# EAGLE design schema (EAGLE 8.3.1)
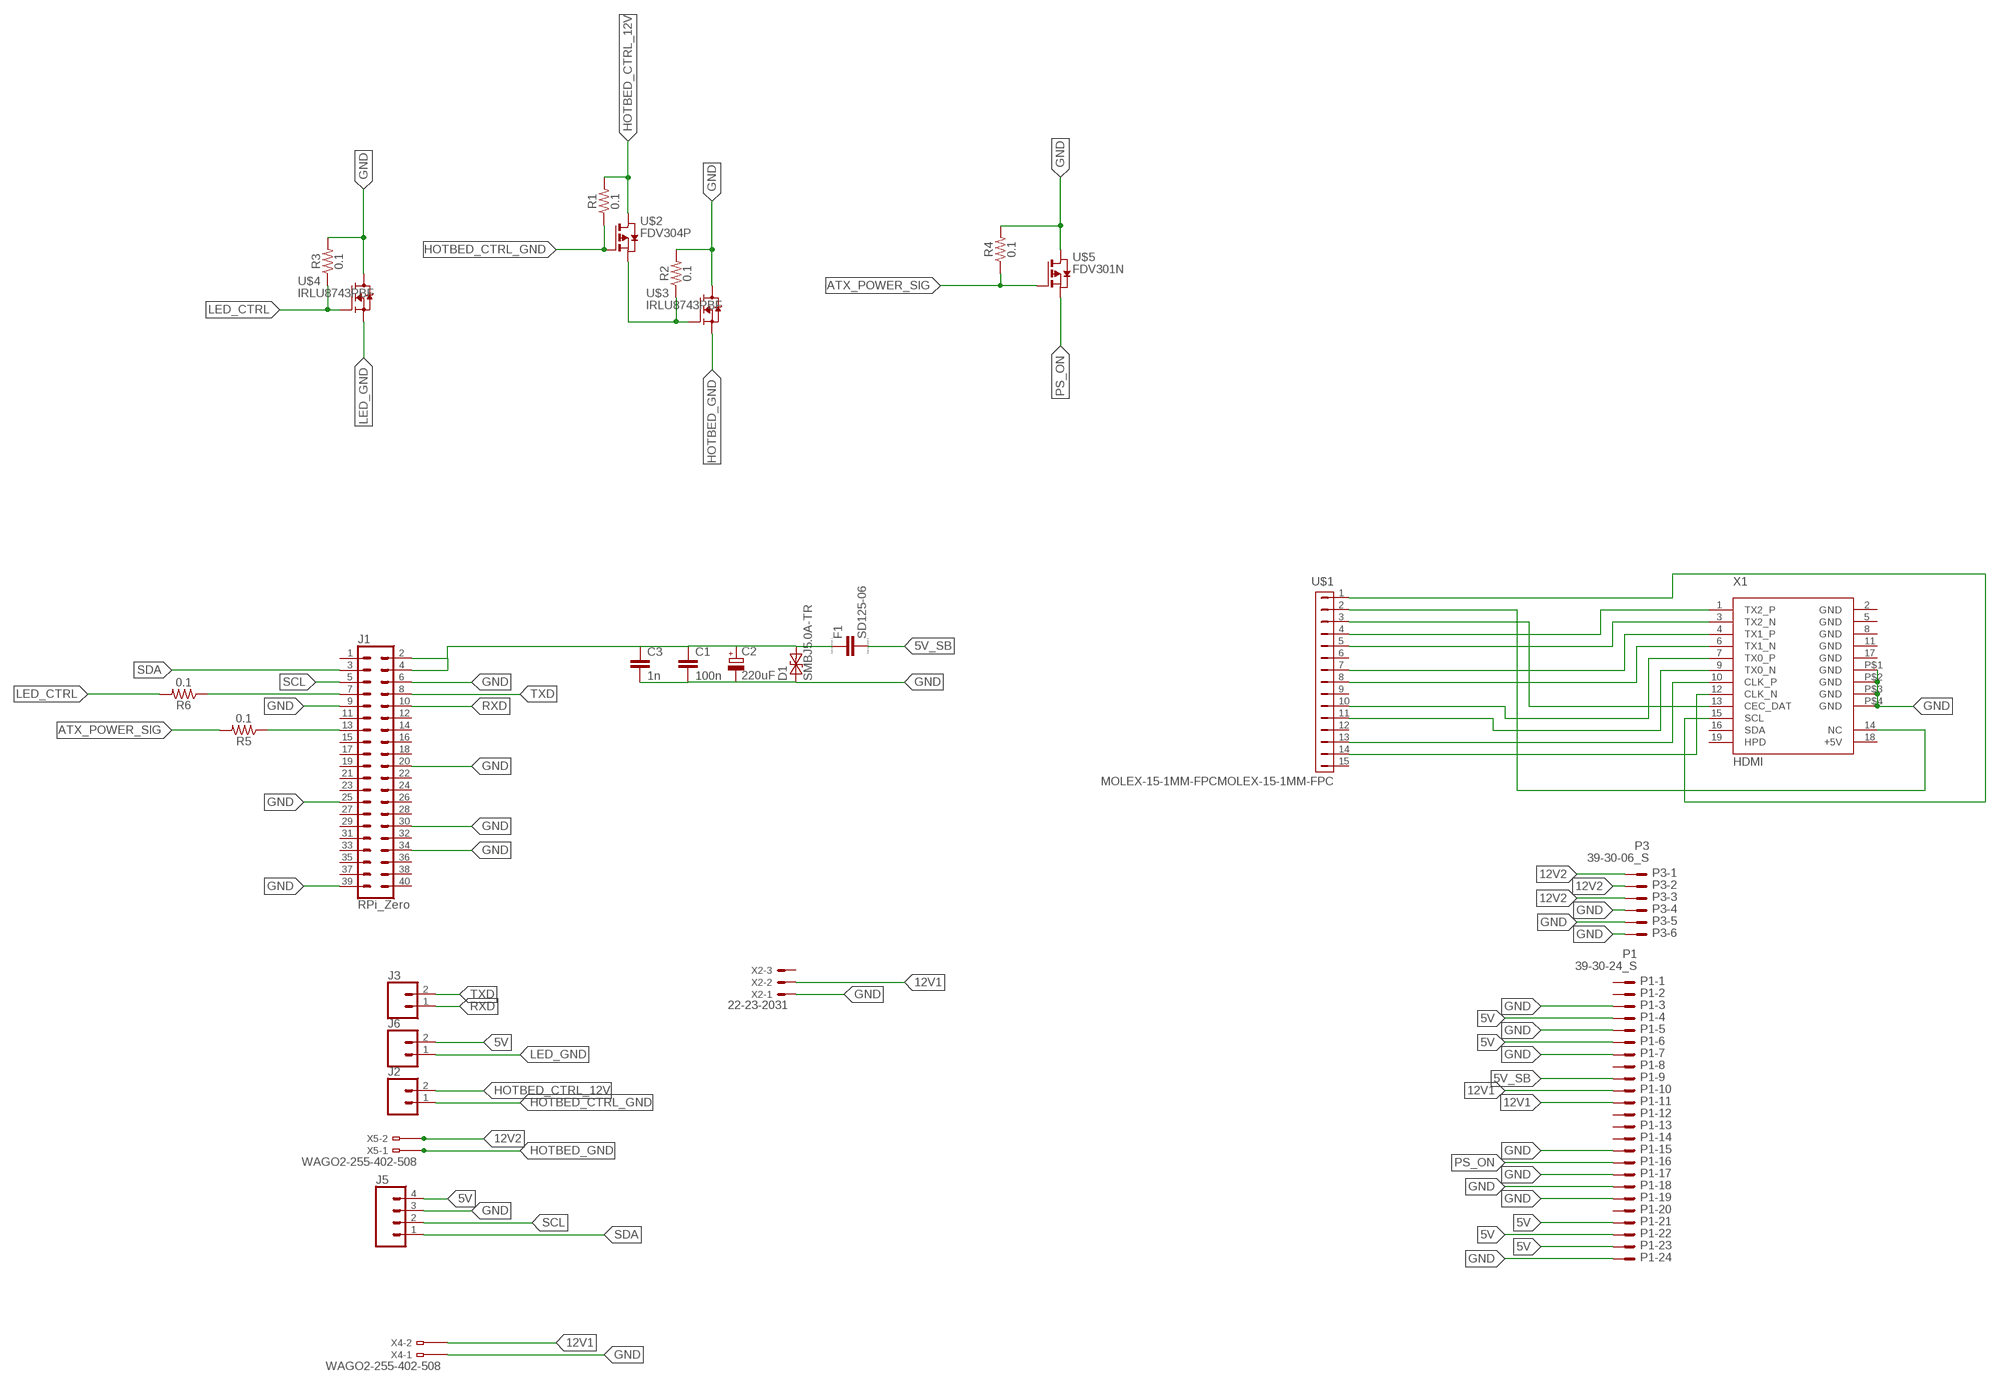
[diagram p0: schematic, sheet 1]

## Parts
C1  100n  C-EUC1206  [C1206]
C2  220uF  CPOL-EUSMCE  [SMC_E]
C3  1n  C-EUC1206  [C1206]
D1  SMBJ5.0A-TR  P6SMB_CA  [SMB]
F1  SD125-06  CC1812  [C1812]
J1  RPi_Zero  CONN_20X2  [2X20]
J2  CONN_02  [1X02]
J3  CONN_02  [1X02]
J5  CONN_04  [1X04]
J6  CONN_025MM  [SCREWTERMINAL-5MM-2]
P1  39-30-24_S  [39-30-?24?]
P3  39-30-06_S  [39-30-?06?]
R1  0.1  0.1OHM-1210-1/2W-1%  [1210]
R2  0.1  0.1OHM-1210-1/2W-1%  [1210]
R3  0.1  0.1OHM-1210-1/2W-1%  [1210]
R4  0.1  0.1OHM-1210-1/2W-1%  [1210]
R5  0.1  0.1OHM-1210-1/2W-1%  [1210]
R6  0.1  0.1OHM-1210-1/2W-1%  [1210]
U$1  MOLEX-15-1MM-FPCMOLEX-15-1MM-FPC  [FH12-15S-1SH]
U$2  FDV304P  [SOT-23]
U$3  IRLU8743PBF  [TO-251AA]
U$4  IRLU8743PBF  [TO-251AA]
U$5  FDV301N  FDV304P  [SOT-23]
X1  HDMI  [HDMI]
X2  22-23-2031  [22-23-2031]
X4  WAGO2-255-402-508  [255-402-508]
X5  WAGO2-255-402-508  [255-402-508]

## Nets
5V: J5.4 J6.2 P1.4 P1.6 P1.21 P1.22 P1.23
5V_SB: F1.2 P1.9
5V_SB_FUSED: C1.1 C2.+ C3.1 D1.2 F1.1 J1.2 J1.4
12V1: P1.10 P1.11 X2.2 X4.B2(-2:B1)
12V2: P3.1 P3.2 P3.3 X5.B2(-2:B1)
ATX_POWER_SIG: R4.1 R5.2 U$5.2(G)
GND: C1.2 C2.- C3.2 D1.1 J1.6 J1.9 J1.20 J1.25 J1.30 J1.34 J1.39 J5.3 P1.3 P1.5 P1.7 P1.15 P1.17 P1.18 P1.19 P1.24 P3.4 P3.5 P3.6 R2.2 R3.2 R4.2 U$3.2(D) U$3.4(D) U$4.2(D) U$4.4(D) U$5.1(D) X1.P$1(GND) X1.P$2(GND) X1.P$3(GND) X1.P$4(GND) X2.1 X4.B1(-1:B1)
GPIO_7: J1.7 R6.1
GPIO_13: J1.13 R5.1
HOTBED_CTRL_12V: J2.2 R1.2 U$2.1(D)
HOTBED_CTRL_GND: J2.1 R1.1 U$2.2(G)
HOTBED_GND: U$3.3(S) X5.B1(-1:B1)
LED_CTRL: R3.1 R6.2 U$4.1(G)
LED_GND: J6.1 U$4.3(S)
N$1: R2.1 U$2.3(S) U$3.1(G)
N$3: U$1.2 X1.14(NC)
N$4: U$1.1 X1.15(SCL)
N$5: U$1.14 X1.12(CLK_N)
N$6: U$1.4 X1.1(TX2_P)
N$7: U$1.5 X1.3(TX2_N)
N$8: U$1.7 X1.4(TX1_P)
N$9: U$1.8 X1.6(TX1_N)
N$10: U$1.10 X1.7(TX0_P)
N$11: U$1.11 X1.9(TX0_N)
N$12: U$1.13 X1.10(CLK_P)
N$13: U$1.3 X1.13(CEC_DAT)
PS_ON: P1.16 U$5.3(S)
RXD: J1.10 J3.1
SCL: J1.5 J5.2
SDA: J1.3 J5.1
TXD: J1.8 J3.2
Unconnected: J1.1 J1.11 J1.12 J1.14 J1.15 J1.16 J1.17 J1.18 J1.19 J1.21 J1.22 J1.23 J1.24 J1.26 J1.27 J1.28 J1.29 J1.31 J1.32 J1.33 J1.35 J1.36 J1.37 J1.38 J1.40 P1.1 P1.2 P1.8 P1.12 P1.13 P1.14 P1.20 U$1.6 U$1.9 U$1.12 U$1.15 X1.2(GND) X1.5(GND) X1.8(GND) X1.11(GND) X1.16(SDA) X1.17(GND) X1.18(+5V) X1.19(HPD) X2.3 X4.A1(-1:A1) X4.A2(-2:A1) X5.A1(-1:A1) X5.A2(-2:A1)

## Library data of the parts
C1 C3 = rcl:C-EU: CAPACITOR, European symbol
C2 = rcl:CPOL-EU: POLARIZED CAPACITOR, European symbol
D1 = _hhn_suppressor_SMAJ_SM6T_P6SMB:P6SMB*CA: P6SMBxxCA Series of bidirectional Transient Voltage Suppressor Diodes xx = Stand-off Voltage VR in Volts; PPmax = 600 W Case: SMB = DO 214 AA Note: Footprint acc. to ST specs; source: www.st.com Author: Dipl.-Ing. FH Rainer Bayer, www.ing-rb.de/hhn Feedback: rainer.bayer@hs-heilbronn.de
F1 = eagle-ltspice:C: CAPACITOR, European symbol; SPICEMODEL: NONE; SPICEPREFIX: C
J1 = SparkFun-Connectors:CONN_20X2: Multi connection point. Often used as Generic Header-pin footprint for 0.1 inch spaced/style header connections On any of the 0.1 inch spaced packages, you can populate with these: Break Away Headers - Straight <https://www.sparkfun.com/products/116> (PRT-00116) Break Away Male Headers - Right Angle <https://www.sparkfun.com/products/553> (PRT-00553) Female Headers <https://www.sparkfun.com/products/115> (PRT-00115) Break Away Headers - Machine Pin <https://www.sparkfun.com/products/117> (PRT-00117) Break Away Female Headers - Swiss Machine Pin <https://www.sparkfun.com/products/743> (PRT-00743)
J2 J3 = SparkFun-Connectors:CONN_02: Multi connection point. Often used as Generic Header-pin footprint for 0.1 inch spaced/style header connections On any of the 0.1 inch spaced packages, you can populate with these: Break Away Headers - Straight <https://www.sparkfun.com/products/116> (PRT-00116) Break Away Male Headers - Right Angle <https://www.sparkfun.com/products/553> (PRT-00553) Female Headers <https://www.sparkfun.com/products/115> (PRT-00115) Break Away Headers - Machine Pin <https://www.sparkfun.com/products/117> (PRT-00117) Break Away Female Headers - Swiss Machine Pin <https://www.sparkfun.com/products/743> (PRT-00743) For SCREWTERMINALS and SPRING TERMINALS visit here: Screw Terimnals on SparkFun.com <https://www.sparkfun.com/search/results?term=Screw+Terminals> (5mm/3.5mm/2.54mm spacing) This device is also useful as a general connection point to wire up your design to another part of your project. Our various solder wires solder well into these plated through hole pads. Hook-Up Wire - Assortment (Stranded, 22 AWG) <https://www.sparkfun.com/products/11375> (PRT-11375) Hook-Up Wire - Assortment (Solid Core, 22 AWG) <https://www.sparkfun.com/products/11367> (PRT-11367) View the entire wire category on our website here <https://www.sparkfun.com/categories/141> Special notes: Molex polarized connector foot print use with: PRT-08233 with associated crimp pins and housings. 2.54_SCREWTERM for use with PRT-10571. 3.5mm Screw Terminal footprints for PRT-08084 5mm Screw Terminal footprints for use with PRT-08432
J5 = SparkFun-Connectors:CONN_04: Multi connection point. Often used as Generic Header-pin footprint for 0.1 inch spaced/style header connections On any of the 0.1 inch spaced packages, you can populate with these: Break Away Headers - Straight <https://www.sparkfun.com/products/116> (PRT-00116) Break Away Male Headers - Right Angle <https://www.sparkfun.com/products/553> (PRT-00553) Female Headers <https://www.sparkfun.com/products/115> (PRT-00115) Break Away Headers - Machine Pin <https://www.sparkfun.com/products/117> (PRT-00117) Break Away Female Headers - Swiss Machine Pin <https://www.sparkfun.com/products/743> (PRT-00743) For SCREWTERMINALS and SPRING TERMINALS visit here: Screw Terimnals on SparkFun.com <https://www.sparkfun.com/search/results?term=Screw+Terminals> (5mm/3.5mm/2.54mm spacing) This device is also useful as a general connection point to wire up your design to another part of your project. Our various solder wires solder well into these plated through hole pads. Hook-Up Wire - Assortment (Stranded, 22 AWG) <https://www.sparkfun.com/products/11375> (PRT-11375) Hook-Up Wire - Assortment (Solid Core, 22 AWG) <https://www.sparkfun.com/products/11367> (PRT-11367) View the entire wire category on our website here <https://www.sparkfun.com/categories/141> Special notes: Molex polarized connector foot print use with SKU : PRT-08231 with associated crimp pins and housings. 1MM SMD Version SKU: PRT-10208; PROD_ID: CONN-09696
J6 = SparkFun-Connectors:CONN_02: Multi connection point. Often used as Generic Header-pin footprint for 0.1 inch spaced/style header connections On any of the 0.1 inch spaced packages, you can populate with these: Break Away Headers - Straight <https://www.sparkfun.com/products/116> (PRT-00116) Break Away Male Headers - Right Angle <https://www.sparkfun.com/products/553> (PRT-00553) Female Headers <https://www.sparkfun.com/products/115> (PRT-00115) Break Away Headers - Machine Pin <https://www.sparkfun.com/products/117> (PRT-00117) Break Away Female Headers - Swiss Machine Pin <https://www.sparkfun.com/products/743> (PRT-00743) For SCREWTERMINALS and SPRING TERMINALS visit here: Screw Terimnals on SparkFun.com <https://www.sparkfun.com/search/results?term=Screw+Terminals> (5mm/3.5mm/2.54mm spacing) This device is also useful as a general connection point to wire up your design to another part of your project. Our various solder wires solder well into these plated through hole pads. Hook-Up Wire - Assortment (Stranded, 22 AWG) <https://www.sparkfun.com/products/11375> (PRT-11375) Hook-Up Wire - Assortment (Solid Core, 22 AWG) <https://www.sparkfun.com/products/11367> (PRT-11367) View the entire wire category on our website here <https://www.sparkfun.com/categories/141> Special notes: Molex polarized connector foot print use with: PRT-08233 with associated crimp pins and housings. 2.54_SCREWTERM for use with PRT-10571. 3.5mm Screw Terminal footprints for PRT-08084 5mm Screw Terminal footprints for use with PRT-08432; SF_SKU: PRT-08432
P1 = con-molex-mini-fit:39-30-?24?_S: HEADER
P3 = con-molex-mini-fit:39-30-?06?_S: HEADER
R1-R6 = SparkFun-Resistors:0.1OHM: 0.1Ω resistor A resistor is a passive two-terminal electrical component that implements electrical resistance as a circuit element. Resistors act to reduce current flow, and, at the same time, act to lower voltage levels within circuits. - Wikipedia; PROD_ID: RES-12374
U$1 = johny007:MOLEX-15-1MM-FPC
U$2 U$5 = johny007:FDV304P
U$3 U$4 = johny007:IRLU8743PBF
X1 = raspberrypi_cm:HDMI
X2 = con-molex:22-23-2031: .100" (2.54mm) Center Header - 3 Pin; MF: MOLEX; MPN: 22-23-2031; OC_FARNELL: 1462950; OC_NEWARK: 30C0862
X4 X5 = con-wago:WAGO2-: WAGO Cage Clamp; OC_FARNELL: unknown; OC_NEWARK: unknown

## Board
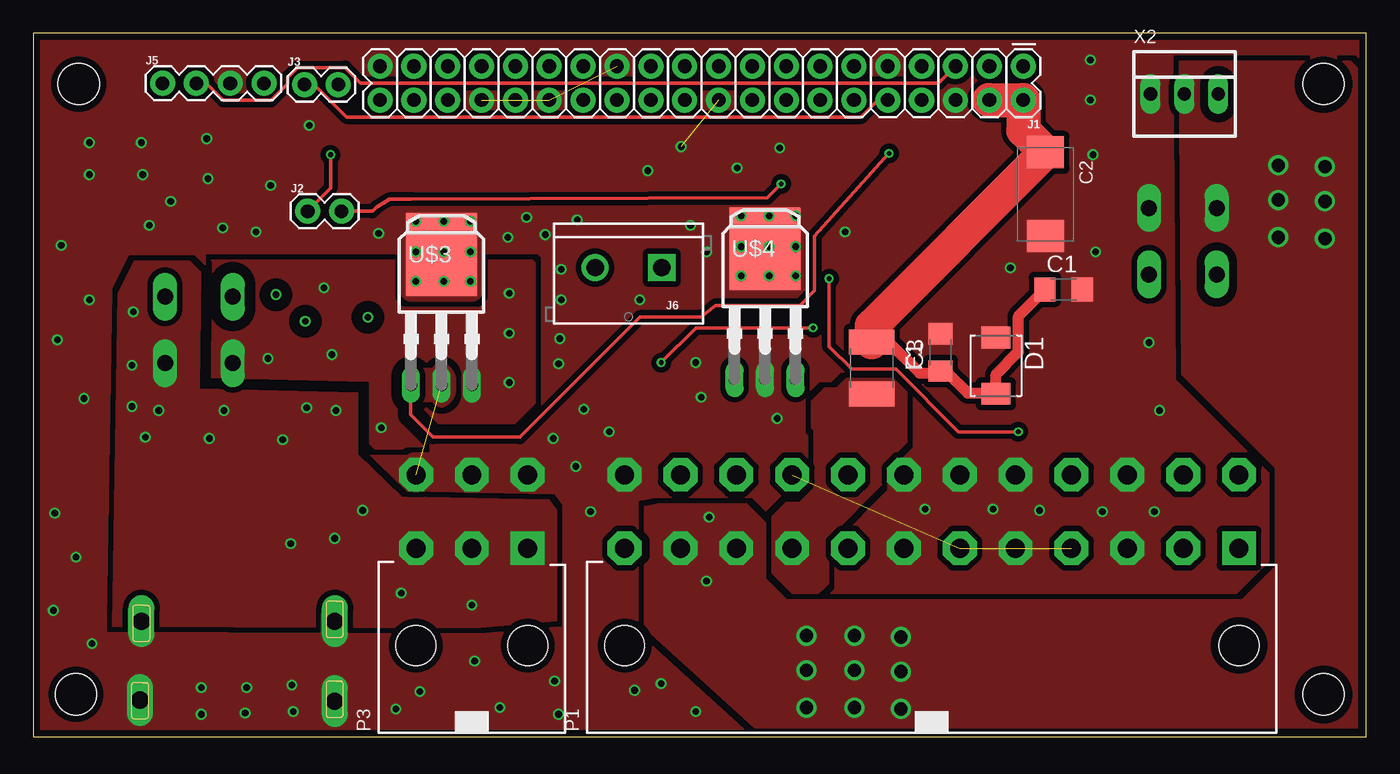
[diagram p1: board, top side]
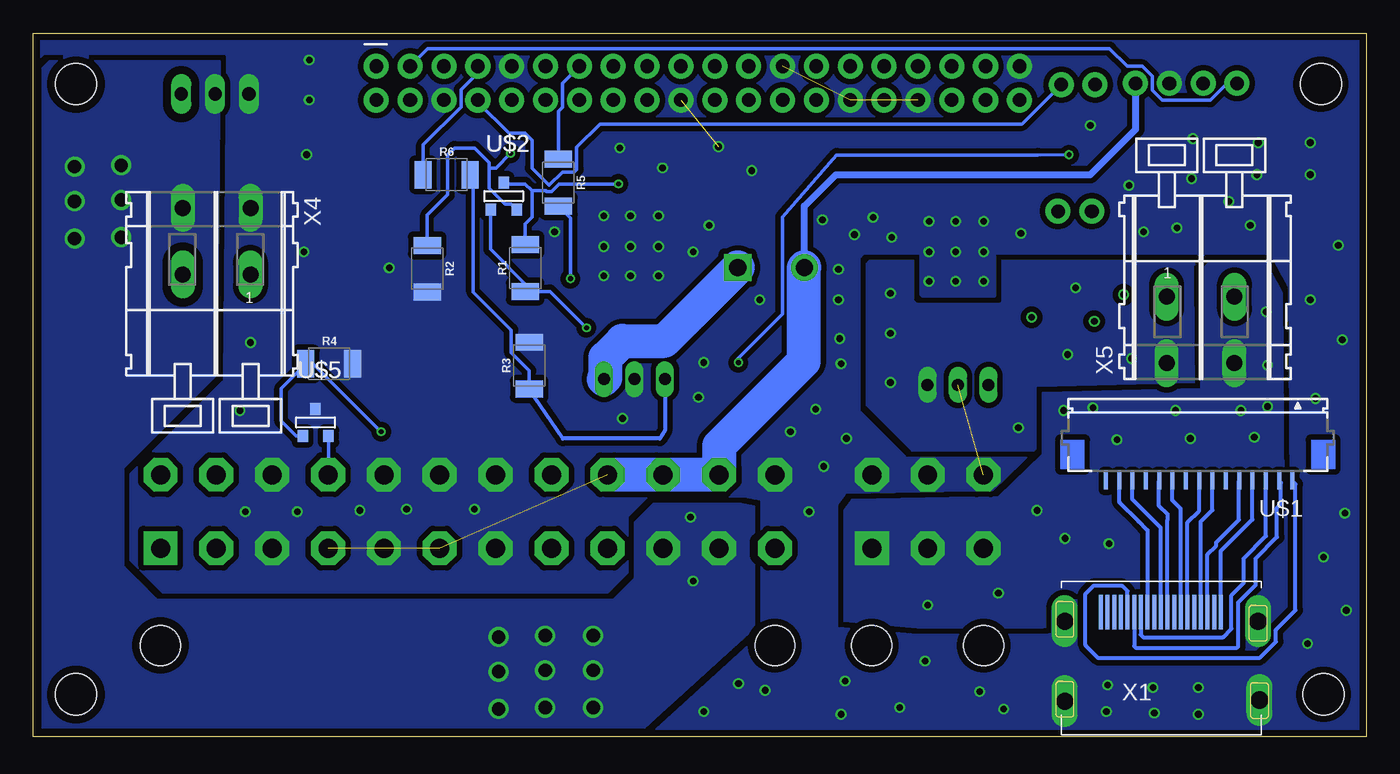
[diagram p2: board, bottom side, seen from below]

Size 100 x 52.81 mm. Coordinates in mm from the lower left corner, seen from the top.
Outline: 0,0 100,0 100,52.81 0,52.81 0,0
Copper layers (1*16): Top 0.035mm / dielectric 1.6mm / Bottom 0.035mm
Design rules "Elecrow_2-layer_PCB_eagle_rule": minimum track width 6mil, minimum drill 12mil, track to track 6mil, track to pad 6mil, pad to pad 6mil, via to via 8mil, smd to smd 0mil, copper to edge 20mil, drill to drill 10mil, minimum pad ring 6mil, minimum via ring 6mil, stop-mask expansion 0mil, vias tented up to drill 100mil, thermal gap 10mil
Holes 3.1 mm at 3.2,3.2 96.8,3.2 3.4,49 96.8,49

### Footprints (pad centres in the part's own frame; a part is rotated, then mirrored left to right if it is on the bottom)
C1206 = smd 1.6 x 1.8: 1 -1.4,0; 2 1.4,0
SMC_E = smd 2.4 x 2.8: + -3.15,0; - 3.15,0
SMB = smd 1.62 x 2.18: 1 -2.11,0; 2 2.11,0
C1812 = smd 1.9 x 3.4: 1 -1.95,0; 2 1.95,0
2X20 = drill 1.016 pad 1.88: 1 0,0; 2 0,2.54; 3 2.54,0; 4 2.54,2.54; 5 5.08,0; 6 5.08,2.54; 7 7.62,0; 8 7.62,2.54; 9 10.16,0; 10 10.16,2.54; 11 12.7,0; 12 12.7,2.54; 13 15.24,0; 14 15.24,2.54; 15 17.78,0; 16 17.78,2.54; 17 20.32,0; 18 20.32,2.54; 19 22.86,0; 20 22.86,2.54; 21 25.4,0; 22 25.4,2.54; 23 27.94,0; 24 27.94,2.54; 25 30.48,0; 26 30.48,2.54; 27 33.02,0; 28 33.02,2.54; 29 35.56,0; 30 35.56,2.54; 31 38.1,0; 32 38.1,2.54; 33 40.64,0; 34 40.64,2.54; 35 43.18,0; 36 43.18,2.54; 37 45.72,0; 38 45.72,2.54; 39 48.26,0; 40 48.26,2.54
1X02 = drill 1.016 pad 1.88: 1 0,0; 2 2.54,0
1X04 = drill 1.016 pad 1.88: 1 0,0; 2 2.54,0; 3 5.08,0; 4 7.62,0
SCREWTERMINAL-5MM-2 = drill 1.3 pad 2.032 square: 1 0,0 | drill 1.3 pad 2.032: 2 5,0
39-30-?24? = drill 1.422 pad 2.54 square: 1 23.05,0 | drill 1.422 pad 2.54 octagon: 2 18.86,0; 3 14.668,0; 4 10.477,0; 5 6.287,0; 6 2.095,0; 7 -2.095,0; 8 -6.287,0; 9 -10.477,0; 10 -14.668,0; 11 -18.86,0; 12 -23.05,0; 13 23.05,5.512; 14 18.86,5.512; 15 14.668,5.512; 16 10.477,5.512; 17 6.287,5.512; 18 2.095,5.512; 19 -2.095,5.512; 20 -6.287,5.512; 21 -10.477,5.512; 22 -14.668,5.512; 23 -18.86,5.512; 24 -23.05,5.512 | hole 3: -23.05,-7.3; 23.05,-7.3
39-30-?06? = drill 1.422 pad 2.54 square: 1 4.191,0 | drill 1.422 pad 2.54 octagon: 2 0,0; 3 -4.191,0; 4 4.191,5.512; 5 0,5.512; 6 -4.191,5.512 | hole 3: -4.191,-7.3; 4.191,-7.3
1210 = smd 1.27 x 2.06: 1 -1.755,0; 2 1.755,0
FH12-15S-1SH = smd 0.3 x 1.3: 1 -7.1,3.25; 2 -6.1,3.25; 3 -5.1,3.25; 4 -4.1,3.25; 5 -3.1,3.25; 6 -2.1,3.25; 7 -1.1,3.25; 8 -0.1,3.25; 9 0.9,3.25; 10 1.9,3.25; 11 2.9,3.25; 12 3.9,3.25; 13 4.9,3.25; 14 5.9,3.25; 15 6.9,3.25
SOT-23 = smd 0.787 x 0.889: 1 -0.025,1.016; 2 -0.991,-1.016; 3 0.94,-1.016
TO-251AA = drill 0.889 long: 1 -2.286,-5.334; 2 0,-5.334; 3 2.286,-5.334 | smd 5.334 x 6.223: 4 0,4.445
HDMI = smd 0.3 x 2.6: 1 4.45,3.7; 2 3.95,3.7; 3 3.45,3.7; 4 2.95,3.7; 5 2.45,3.7; 6 1.95,3.7; 7 1.45,3.7; 8 0.95,3.7; 9 0.45,3.7; 10 -0.05,3.7; 11 -0.55,3.7; 12 -1.05,3.7; 13 -1.55,3.7; 14 -2.05,3.7; 15 -2.55,3.7; 16 -3.05,3.7; 17 -3.55,3.7; 18 -4.05,3.7; 19 -4.55,3.7 | drill 1.3 long: P$1 7.25,3; P$2 -7.25,3; P$3 -7.25,-3; P$4 7.35,-2.9
22-23-2031 = drill 1 long: 1 -2.54,0; 2 0,0; 3 2.54,0
255-402-508 = drill 1.2 long: A1 -2.54,0; A2 2.54,0; B1 -2.54,-5; B2 2.54,-5

### Placement (x,y rotation side)
C1  77.29,33.58 0 top
C2  75.93,40.73 270 top
C3  68.07,28.87 90 top
D1  72.22,27.87 270 top
F1  62.9,27.69 270 top
J1  74.27,50.34 180 top
J2  20.58,39.46 0 top
J3  20.34,48.96 0 top
J5  9.69,49.06 0 top
J6  47.15,35.23 180 top
P1  39-30-24?_S  [39-30-?24?]  67.41,14.17 0 top
P3  39-30-06?_S  [39-30-?06?]  32.9,14.17 0 top
R1  63.1,35.2 90 bottom
R2  70.45,35.14 270 bottom
R3  62.79,27.87 90 bottom
R4  77.8,28 0 bottom
R5  60.6,41.6 270 bottom
R6  69,42.2 0 bottom
U$1  12.63,22.47 180 bottom
U$2  64.68,40.59 0 bottom
U$3  30.62,31.76 0 top
U$4  54.9,32.19 0 top
U$5  78.8,23.6 0 bottom
X1  15.36,5.68 0 bottom
X2  86.36,48.26 0 top
X4  86.25,34.71 180 bottom
X5  12.42,33.05 0 bottom

### Tracks (layer width: path | path; a pad name or v marks a point on that pad's centre or on a via)
5V  (2 unrouted)
  Bottom 0.254: P1.22 53,20 53,19.68
  Bottom 0.508: J6.2 42.15,39.85 39.8,42.2 20.7,42.2 17.3,45.6 J5.4
  Bottom 2.54: J6.2 42.2,35.18 42.2,28.2 48.55,21.85 P1.23 P1.22 53,19.68 P1.21
5V_SB
  pour Top (isolate 0.406, rank 3, no thermals): 56.7,10.5 55.3,11.9 55.3,16.4 56.5,17.6 57.5,17.6 58.6,18.7 58.6,23 58.4,23.2 58.4,25.1 58.4,25.2 59.4,26.2 60.3,26.2 61,26.9 64.5,26.9 65.5,25.9 65.5,22.1 63.9,20.5 63.9,19.2 59.6,14.9 59.6,11.5 58.6,10.5
5V_SB_FUSED
  Top 0.813: C1.1 73.92,31.61 73.92,28.92 72.22,27.22 D1.2 72.18,25.8 70.1,25.8 68.43,27.47 C3.1 67.9,27.3 66.5,27.3 64.16,29.64 F1.1
  Top 2.54: J1.4 J1.2 74.27,45.54 C2.+ 62.9,30.85 F1.1
12V1  (via drill 0.5, 1)
  other vias: 58,7.6 58,2.2 58,5 61.6,7.6 61.6,2.2 61.6,5 65.1,7.5 65.1,2.1 65.1,4.9 93.4,42.9 93.4,37.5 93.4,40.3 96.9,42.8 96.9,37.4 96.9,40.2 50.5,11.7 50.7,16.5
  pour Bottom (isolate 0.61, no thermals): 86,50.7 98.8,50.7 100,49.5 100,-0.1 55,-0.1 45.9,8.2 45.9,17.3 46.9,17.5 53.5,17.5 54.9,16.1 54.9,11.9 56.5,10.3 90.7,10.3 93.2,12.8 93.2,20.2 86.2,27.2
  pour Top (isolate 0.61, no thermals): 86,50.7 98.8,50.7 100,49.5 100,-0.1 55,-0.1 45.9,8.2 45.9,17.3 46.9,17.5 53.5,17.5 54.9,16.1 54.9,11.9 56.5,10.3 90.7,10.3 93.2,12.8 93.2,20.2 86.2,27.2
12V2  (via drill 0.5)
  other vias: 24.7,17 22.6,14.9 32.9,9.9 22.7,24.5 27.6,10.8 19.3,14.5 18.7,22.3 20.5,24.7 14.3,24.5 13.2,22.4 9.4,24.5 8.4,22.5 7.4,24.8 7.4,27.9 7.5,31.9
  pour Top (isolate 0.406, rank 4, no thermals): 39.2,17 39.2,8.7 33.1,8.2 6,8.3 6.4,33.3 7.6,35.7 11.7,35.7 12.5,34.9 12.4,26.1 24.3,25.8 24.3,21.2 27.6,18 38.6,17.8
  pour Bottom (isolate 0.406, rank 4, no thermals): 39.2,17 39.2,8.7 33.3,8.2 6.1,8.3 6.3,33.3 7.6,35.7 11.7,35.7 12.5,34.9 12.4,26.1 24.3,25.8 24.3,21.2 27.6,18 38.6,17.8
ATX_POWER_SIG  (via drill 0.35)
  Top 0.254: v73.9,22.9 69.4,22.9 64.7,27.6 61.4,27.6 59.7,29.3 v59.7,34.4
  Bottom 0.254: U$5.2 80.28,22.58 81.4,23.7 81.4,26.16 R4.1 79,28 v73.9,22.9 | v59.7,34.4 59.7,38.95 R5.2
GND  (via drill 0.5)  (4 unrouted)
  other vias: 28.7,38.7 30.8,38.7 28.7,36.4 30.8,36.4 28.7,34.2 30.8,34.2 32.8,36.4 32.8,38.7 32.8,34.2 53.1,39.1 55.2,39.1 53.1,36.8 55.2,36.8 53.1,34.6 55.2,34.6 57.2,36.8 57.2,39.1 57.2,34.6 4.2,44.6 4.2,42.2 8.1,44.6 8.2,42.2 13,44.9 13.1,41.9 20.7,45.9 46.1,42.5 48.6,44.3 52.8,42.7 56,44.2 73.3,35.2 79.7,36.4 79.5,43.7 79.3,47.8 79.3,50.8 83.7,29.6 84.5,24.5 50.1,25.5 49.7,28.1 55.8,23.9 60.9,37.9 66.9,17.1 72,17.1 75.5,17 80.2,16.9 84.1,16.9 47.1,4 49.7,1.9 45.1,3.5 39.1,4.2 39.4,1.7 35,2.2 33.1,5.7 29,3.4 27.2,2.1 19.4,3.9 19.5,1.9 16,3.7 15.9,1.8 12.6,3.7 12.6,1.7 4.4,7 1.5,9.5 3.2,13.5 1.6,16.8 3.8,25.4 1.8,29.8 4.2,32.8 2.1,36.9 8.7,38.4 10.3,40.2 14.2,38.2 16.7,37.9 17.8,41.4 25.9,37.8 35.6,37.5 37,39 39.4,28 39.5,29.9 39.6,32.8 39.6,35.1 38.4,37.7 40.8,38.8 49.3,38.4 50.5,36.4 45.5,32.8 39,22.4 41.3,24.6 43.2,22.9 40.7,20.3 41.8,16.9
  pour Top (isolate 0.406, rank 6, no thermals): 0.1,52.9 100.2,52.9 100.2,0.3 100,0.1 0,0.1 -0.1,0.2 -0.1,52.7
  pour Bottom (isolate 0.406, rank 6, no thermals): 0.1,52.9 100.2,52.9 100.2,0.3 100,0.1 0,0.1 -0.1,0.2 -0.1,52.7
  pour Bottom (isolate 0.813): 27.9,39.4 33.3,39.4 33.4,39.3 33.4,33.2 33.3,33.1 27.9,33.1
GPIO_7
  Bottom 0.254: R6.1 70.75,44.44 67.92,47.27 67.92,48.58 66.8,49.7 66.8,50.19 J1.7
GPIO_13
  Bottom 0.254: R5.1 60.6,46.97 60.3,47.27 60.3,49.07 J1.13
HOTBED_CTRL_12V  (via drill 0.35)
  Top 0.254: J2.2 25.44,39.46 25.75,39.77 26.73,40.37 28.35,40.38 55.08,40.48 v56.1,41.5
  Bottom 0.254: R1.2 63.1,38.5 62.6,39 62.6,41 | 62.6,41 63.1,41.5 64.6,41.5 U$2.1 | v56.1,41.5 60.55,41.5 61.11,40.94 61.49,40.94 61.55,41 62.6,41
HOTBED_CTRL_GND  (via drill 0.35)
  Top 0.254: v58.5,30.7 49.7,30.7 v47.1,28.1 | v22.3,43.7 22.3,41.18 J2.1
  Bottom 0.254: U$2.2 65.7,39.55 65.7,36.6 63.1,34 R1.1 61.24,33.45 v58.5,30.7 | v22.3,43.7 24.62,43.68 39.74,43.68 43.8,39.03 43.8,31.73 47.26,28.26 v47.1,28.1
HOTBED_GND  (via drill 0.5)
  other vias: 17.6,28.4 21.8,33.7 22.4,28.7 35.7,26.6 35.7,30.3 35.7,33.3 26.1,23.2
  pour Bottom (isolate 0.406, rank 5, no thermals): 12.8,35 12.8,35.4 13.1,35.7 37.3,35.7 37.5,35.5 37.5,24.9 34.1,21.5 24.6,21.5 24.6,26.2 12.7,26.3 12.9,34.9
  pour Top (isolate 0.813, rank 5, no thermals): 12.9,35.1 12.9,35.5 13.2,35.8 37.4,35.8 37.6,35.6 37.6,25 34.2,21.6 24.7,21.6 24.7,26.3 12.8,26.4 13,35
LED_CTRL
  Bottom 0.254: R3.1 62.79,27.49 64.15,28.85 64.15,30.55 67,33.4 67,41.95 R6.2
  Bottom 0.305: U$4.1 52.61,22.99 53,22.4 60.27,22.4 R3.1
LED_GND
  Bottom 2.54: J6.1 52.65,29.73 55.8,29.73 57.07,28.45 57.07,26.97 U$4.3
N$1  (via drill 0.35)
  Top 0.254: v64.2,43.8 58.6,37.6 58.6,33.49 57.5,32.39 51.19,32.39 50.1,31.5 45.5,31.5 36.5,22.5 30,22.5 28.3,24.2 28.3,26.39 U$3.1
  Bottom 0.254: R2.1 70.45,39.15 68.9,40.7 68.9,43.7 68.4,44.2 66.9,44.2 65.8,43.1 65.8,42.7 | 65.8,42.7 65.8,41.2 64.6,40 64.17,40 U$2.3 | 65.8,42.7 65.3,42.7 v64.2,43.8
N$3
  Bottom 0.305: X1.14 17.41,6.81 17.3,6.7 9.7,6.7 9.6,6.8 9.6,10.1 8.3,11.4 8.3,13.4 6.7,15 6.7,17.2 6.4,17.5 6.4,19.09 U$1.2
N$4
  Bottom 0.305: X1.15 17.91,10.96 18.29,11.34 20.48,11.34 21.07,10.76 21.07,6.89 20.08,5.9 8.03,5.9 6.78,7.15 6.78,8.03 5.3,9.51 5.3,18.99 U$1.1
N$5
  Bottom 0.305: X1.12 16.41,15.52 17.06,16.17 | 17.06,16.17 | 17.06,16.17 18.52,17.62 18.52,19.21 U$1.14
N$6
  Bottom 0.305: X1.1 10.91,13.96 8.54,16.32 8.54,19.21 U$1.4
N$7
  Bottom 0.305: X1.3 11.91,13.7 11.25,14.36 11.25,14.6 9.55,16.3 9.55,19.2 U$1.5
N$8
  Bottom 0.305: X1.4 12.41,16.17 11.54,17.04 U$1.7
N$9
  Bottom 0.305: X1.6 13.41,16.09 12.52,16.97 U$1.8
N$10
  Bottom 0.305: X1.7 13.91,17.13 14.54,17.76 U$1.10
N$11
  Bottom 0.305: X1.9 14.91,16.31 14.89,16.32 14.89,16.71 15.54,17.35 15.54,19.21 U$1.11
N$12
  Bottom 0.305: X1.10 15.41,15.7 17.53,17.82 U$1.13
N$13
  Bottom 0.305: X1.13 16.91,7.67 16.73,7.49 10.73,7.49 10.11,8.12 10.11,10.64 9.19,11.56 9.19,13.4 7.51,15.07 7.51,19.2 U$1.3
N$121  (via drill 0.5)
  other vias: 18.2,33.2
N$122  (via drill 0.5)
  other vias: 20.4,31.2
N$123  (via drill 0.5)
  other vias: 25.1,31.5
PS_ON
  Bottom 0.254: U$5.3 77.86,19.71 P1.16
RXD
  Top 0.254: J3.1 21.08,48.96 23.51,46.53 62.1,46.53 63.37,47.8 J1.10
SCL
  Top 0.254: J5.2 12.97,49.06 14.24,47.79 17.84,47.79 19.07,49.02 19.07,49.49 19.81,50.23 23.41,50.23 24.57,49.07 67.92,49.07 J1.5
SDA
  Bottom 0.254: J5.1 10.43,49.06 11.7,47.79 15.3,47.79 16.04,48.53 16.04,49.59 16.78,50.33 17.93,50.33 19.27,51.67 70.4,51.67 J1.3
TXD
  Bottom 0.254: J1.8 66.65,47.65 64.3,45.3 63.1,45.3 62.6,44.8 62.6,42.7 61.3,41.4 60.31,42.39 59.43,42.39 59.24,42.58 59.24,44.26 57.5,46 25.84,46 J3.2